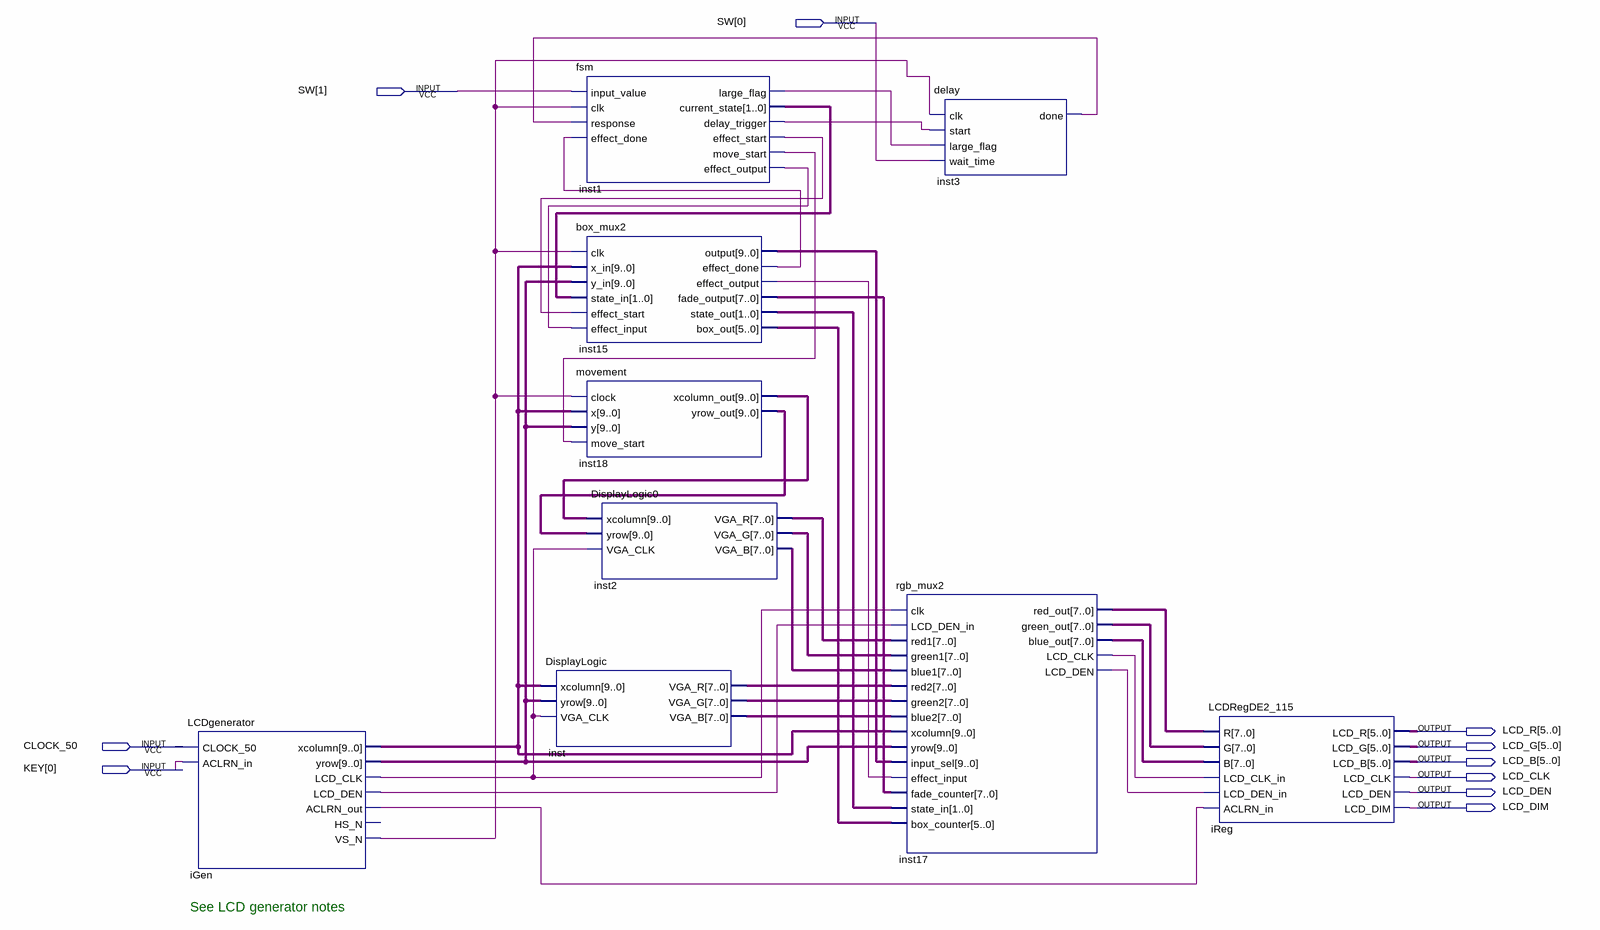
[diagram p0: schematic sheet]
// Quartus schematic Demo_LCD0.bdf as structural Verilog: 9 symbols, 10 pins
module Demo_LCD0 (
  input  [1:0] SW,
  input  CLOCK_50,
  input  [0:0] KEY,
  output [5:0] LCD_R,
  output [5:0] LCD_G,
  output [5:0] LCD_B,
  output LCD_CLK,
  output LCD_DEN,
  output LCD_DIM
);

  wire iGen_aclrn_out, iGen_lcd_clk, iGen_lcd_den, iGen_vs_n, inst1_delay_trigger, inst1_effect_output,
       inst1_effect_start, inst1_large_flag, inst1_move_start, inst3_done, inst15_effect_done,
       inst15_effect_output, inst17_lcd_clk, inst17_lcd_den;
  wire [1:0] inst1_current_state, inst15_state_out;
  wire [5:0] inst15_box_out;
  wire [7:0] inst2_vga_b, inst2_vga_g, inst2_vga_r, inst15_fade_output, inst17_blue_out, inst17_green_out,
       inst17_red_out, inst_vga_b, inst_vga_g, inst_vga_r;
  wire [9:0] iGen_xcolumn, iGen_yrow, inst15_output, inst18_xcolumn_out, inst18_yrow_out;

  LCDgenerator iGen (
    .CLOCK_50(CLOCK_50), .ACLRN_in(KEY[0]), .xcolumn(iGen_xcolumn), .yrow(iGen_yrow), .LCD_CLK(iGen_lcd_clk),
    .LCD_DEN(iGen_lcd_den), .ACLRN_out(iGen_aclrn_out), .VS_N(iGen_vs_n));  // open: HS_N
  DisplayLogic inst (
    .xcolumn(iGen_xcolumn), .yrow(iGen_yrow), .VGA_CLK(iGen_lcd_clk), .VGA_R(inst_vga_r), .VGA_G(inst_vga_g),
    .VGA_B(inst_vga_b));
  fsm inst1 (
    .input_value(SW[1]), .clk(iGen_vs_n), .response(inst3_done), .effect_done(inst15_effect_done),
    .large_flag(inst1_large_flag), .current_state(inst1_current_state), .delay_trigger(inst1_delay_trigger),
    .effect_start(inst1_effect_start), .move_start(inst1_move_start), .effect_output(inst1_effect_output));
  box_mux2 inst15 (
    .clk(iGen_vs_n), .x_in(iGen_xcolumn), .y_in(iGen_yrow), .state_in(inst1_current_state),
    .effect_start(inst1_effect_start), .effect_input(inst1_effect_output), .\output (inst15_output),
    .effect_done(inst15_effect_done), .effect_output(inst15_effect_output), .fade_output(inst15_fade_output),
    .state_out(inst15_state_out), .box_out(inst15_box_out));
  movement inst18 (
    .clock(iGen_vs_n), .x(iGen_xcolumn), .y(iGen_yrow), .move_start(inst1_move_start),
    .xcolumn_out(inst18_xcolumn_out), .yrow_out(inst18_yrow_out));
  DisplayLogic0 inst2 (
    .xcolumn(inst18_xcolumn_out), .yrow(inst18_yrow_out), .VGA_CLK(iGen_lcd_clk), .VGA_R(inst2_vga_r),
    .VGA_G(inst2_vga_g), .VGA_B(inst2_vga_b));
  rgb_mux2 inst17 (
    .clk(iGen_lcd_clk), .LCD_DEN_in(iGen_lcd_den), .red1(inst2_vga_r), .green1(inst2_vga_g),
    .blue1(inst2_vga_b), .red2(inst_vga_r), .green2(inst_vga_g), .blue2(inst_vga_b), .xcolumn(iGen_xcolumn),
    .yrow(iGen_yrow), .input_sel(inst15_output), .effect_input(inst15_effect_output),
    .fade_counter(inst15_fade_output), .state_in(inst15_state_out), .box_counter(inst15_box_out),
    .red_out(inst17_red_out), .green_out(inst17_green_out), .blue_out(inst17_blue_out),
    .LCD_CLK(inst17_lcd_clk), .LCD_DEN(inst17_lcd_den));
  delay inst3 (
    .clk(iGen_vs_n), .start(inst1_delay_trigger), .large_flag(inst1_large_flag), .wait_time(SW[0]),
    .done(inst3_done));
  LCDRegDE2_115 iReg (
    .R(inst17_red_out), .G(inst17_green_out), .B(inst17_blue_out), .LCD_CLK_in(inst17_lcd_clk),
    .LCD_DEN_in(inst17_lcd_den), .ACLRN_in(iGen_aclrn_out), .LCD_R(LCD_R), .LCD_G(LCD_G), .LCD_B(LCD_B),
    .LCD_CLK(LCD_CLK), .LCD_DEN(LCD_DEN), .LCD_DIM(LCD_DIM));

  // Notes on the sheet:
  //   See LCD generator notes
endmodule
